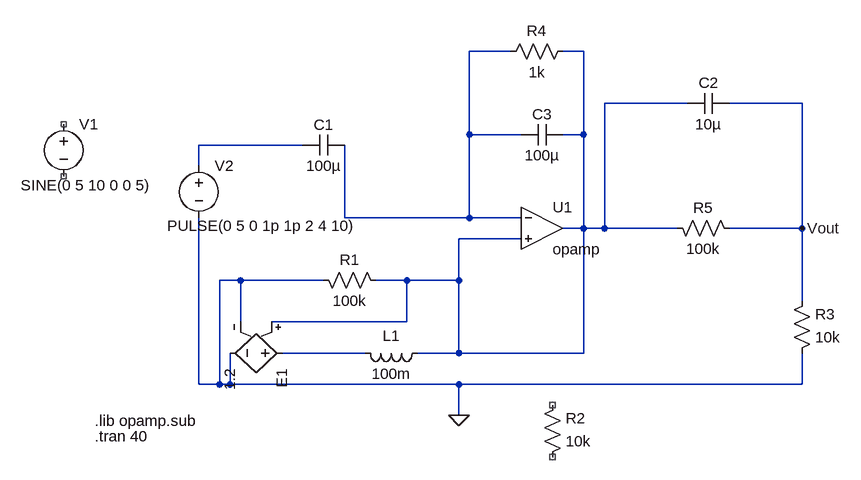
[diagram p0: schematic OpAmp_Differential_Amplifier.asc]
OpAmp_Differential_Amplifier.asc, the LTspice schematic file:
Version 4
SHEET 1 1028 680
WIRE 512 -112 448 -112
WIRE 624 -112 592 -112
WIRE 784 -32 656 -32
WIRE 960 -32 848 -32
WIRE 448 16 448 -112
WIRE 528 16 448 16
WIRE 624 16 624 -112
WIRE 624 16 592 16
WIRE 192 32 32 32
WIRE 32 64 32 32
WIRE 256 144 256 32
WIRE 448 144 448 16
WIRE 448 144 256 144
WIRE 528 144 448 144
WIRE 624 160 624 16
WIRE 624 160 592 160
WIRE 656 160 656 -32
WIRE 656 160 624 160
WIRE 768 160 656 160
WIRE 960 160 960 -32
WIRE 960 160 848 160
WIRE 528 176 432 176
WIRE 96 240 64 240
WIRE 224 240 96 240
WIRE 352 240 304 240
WIRE 432 240 432 176
WIRE 432 240 352 240
WIRE 960 272 960 160
WIRE 96 304 96 240
WIRE 352 304 352 240
WIRE 352 304 144 304
WIRE 288 352 160 352
WIRE 432 352 432 240
WIRE 432 352 368 352
WIRE 624 352 624 160
WIRE 624 352 432 352
WIRE 32 400 32 144
WIRE 64 400 64 240
WIRE 64 400 32 400
WIRE 80 400 80 352
WIRE 80 400 64 400
WIRE 432 400 80 400
WIRE 960 400 960 352
WIRE 960 400 432 400
WIRE 432 448 432 400
FLAG 432 448 0
FLAG 960 160 Vout
SYMBOL voltage -176 -16 R0
WINDOW 123 0 0 Left 0
WINDOW 39 0 0 Left 0
WINDOW 3 -66 110 Left 2
SYMATTR Value SINE(0 5 10 0 0 5)
SYMATTR InstName V1
SYMBOL cap 192 16 M90
WINDOW 0 0 32 VBottom 2
WINDOW 3 32 32 VTop 2
SYMATTR InstName C1
SYMATTR Value 100µ
SYMBOL cap 784 -48 M90
WINDOW 0 0 32 VBottom 2
WINDOW 3 32 32 VTop 2
SYMATTR InstName C2
SYMATTR Value 10µ
SYMBOL res 208 224 M90
WINDOW 0 0 56 VBottom 2
WINDOW 3 32 56 VTop 2
SYMATTR InstName R1
SYMATTR Value 100k
SYMBOL res 560 528 M180
WINDOW 0 36 76 Left 2
WINDOW 3 36 40 Left 2
SYMATTR InstName R2
SYMATTR Value 10k
SYMBOL res 944 368 M180
WINDOW 0 36 76 Left 2
WINDOW 3 36 40 Left 2
SYMATTR InstName R3
SYMATTR Value 10k
SYMBOL res 496 -96 R270
WINDOW 0 32 56 VTop 2
WINDOW 3 0 56 VBottom 2
SYMATTR InstName R4
SYMATTR Value 1k
SYMBOL ind 272 336 M90
WINDOW 0 5 56 VBottom 2
WINDOW 3 32 56 VTop 2
SYMATTR InstName L1
SYMATTR Value 100m
SYMBOL e 176 352 R90
SYMATTR InstName E1
SYMATTR Value 1.2
SYMBOL OpAmps\\opamp 560 96 R0
SYMATTR InstName U1
SYMBOL res 752 144 M90
WINDOW 0 0 56 VBottom 2
WINDOW 3 32 56 VTop 2
SYMATTR InstName R5
SYMATTR Value 100k
SYMBOL voltage 32 48 R0
WINDOW 123 0 0 Left 0
WINDOW 39 0 0 Left 0
WINDOW 3 -49 108 Left 2
SYMATTR InstName V2
SYMATTR Value PULSE(0 5 0 1p 1p 2 4 10)
SYMBOL cap 528 0 M90
WINDOW 0 0 32 VBottom 2
WINDOW 3 32 32 VTop 2
SYMATTR InstName C3
SYMATTR Value 100µ
TEXT -128 456 Left 2 !.lib opamp.sub
TEXT -128 480 Left 2 !.tran 40

The netlist it stands for:
* OpAmp_Differential_Amplifier.asc
V1 NC_01 NC_02 SINE(0 5 10 0 0 5)
C1 N003 N001 100µ
C2 N002 Vout 10µ
R1 0 N002 100k
R2 NC_03 NC_04 10k
R3 0 Vout 10k
R4 N001 N002 1k
L1 N004 N002 100m
E1 N004 0 N002 0 1.2
XU1 N001 N002 N002 opamp Aol=100K GBW=10Meg  ; pins invin noninvin out
R5 N002 Vout 100k
V2 N003 0 PULSE(0 5 0 1p 1p 2 4 10)
C3 N001 N002 100µ
.lib opamp.sub
.tran 40
.backanno
.end